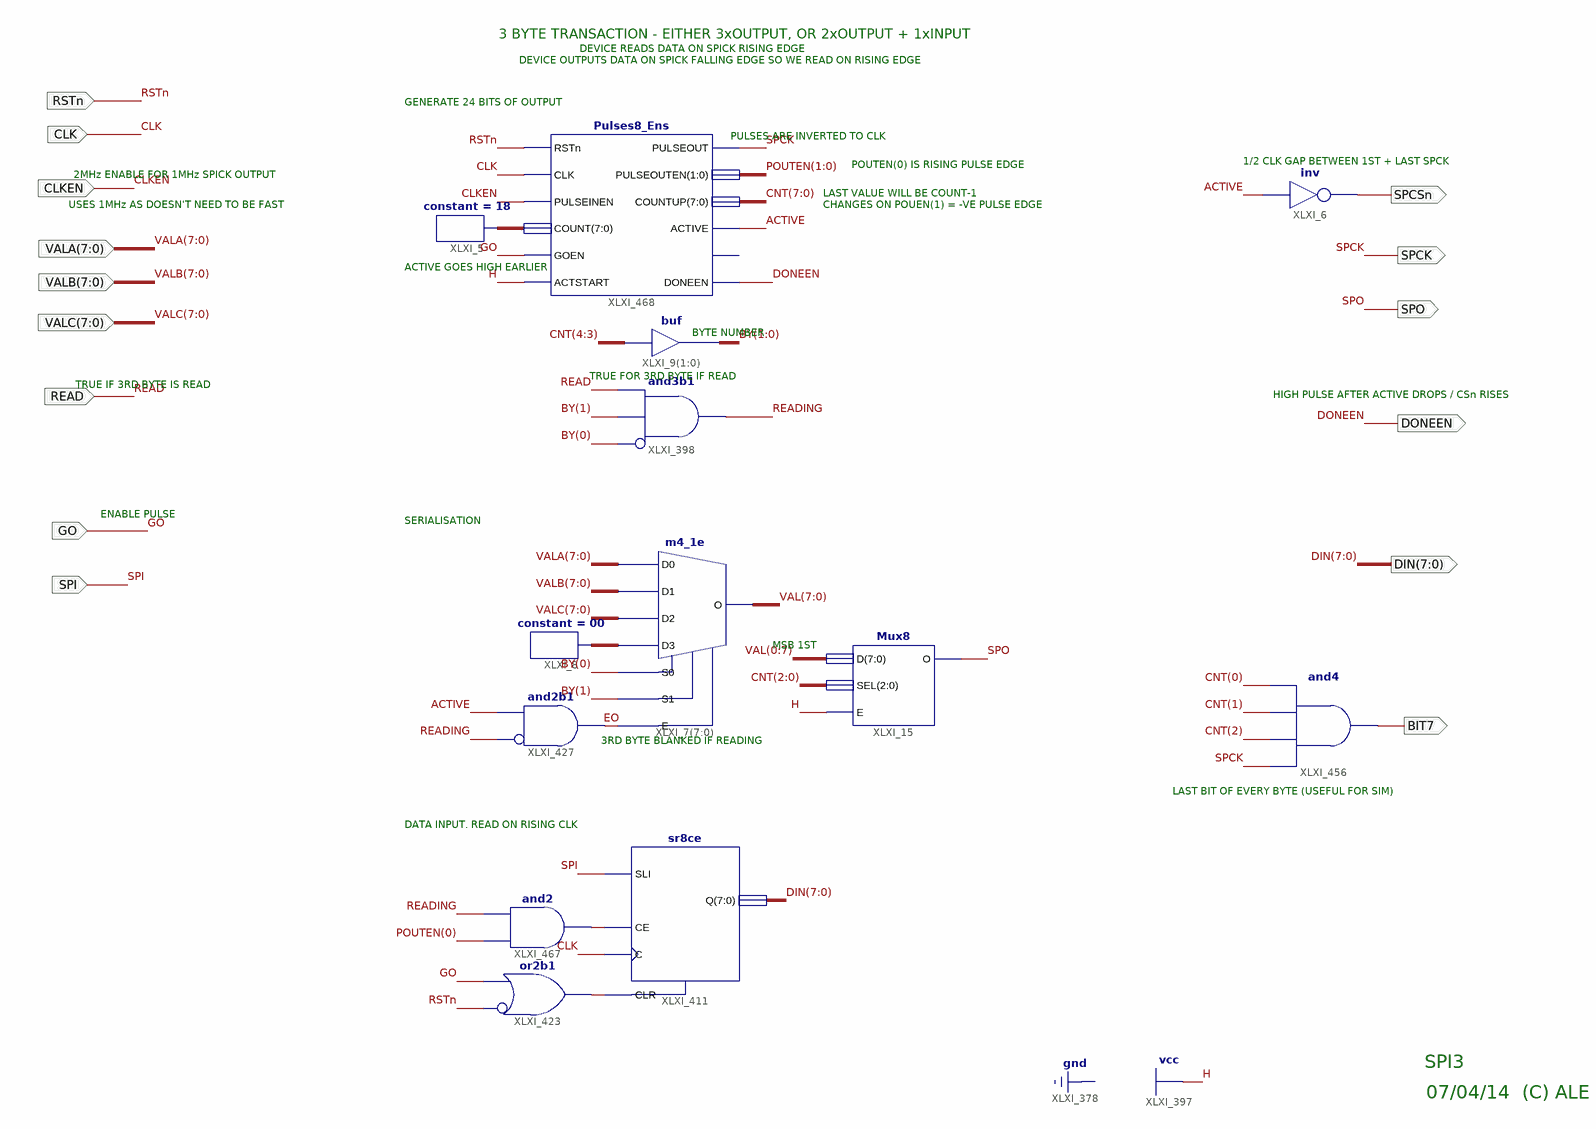
[diagram p0: schematic sheet 1]
// Xilinx ISE schematic Spi3.sch (spartan3e) as structural Verilog: 13 symbols, 15 ports
module Spi3 (
  input  RSTn,
  input  CLK,
  input  [7:0] VALA,
  input  [7:0] VALB,
  input  [7:0] VALC,
  input  READ,
  input  GO,
  input  SPI,
  input  CLKEN,
  output SPCK,
  output SPO,
  output [7:0] DIN,
  output SPCSn,
  output DONEEN,
  output BIT7
);

  wire ACTIVE, EO, READING, XLXN_129, XLXN_165;
  wire [1:0] BY, POUTEN;
  wire [7:0] CNT, VAL, XLXN_7, XLXN_23;

  m4_1e XLXI_7[7:0] (.D0(VALA), .D1(VALB), .D2(VALC), .D3(XLXN_23), .E(EO), .S0(BY[0]), .S1(BY[1]), .O(VAL));
  constant #(.CValue("00")) XLXI_8 (.O(XLXN_23));
  and XLXI_427 (EO, ~READING, ACTIVE);  // and2b1
  Mux8 XLXI_15 (
    .D({VAL[0], VAL[1], VAL[2], VAL[3], VAL[4], VAL[5], VAL[6], VAL[7]}), .E(1'b1), .O(SPO), .SEL(CNT[2:0]));
  not XLXI_6 (SPCSn, ACTIVE);
  sr8ce XLXI_411 (.C(CLK), .CE(XLXN_165), .CLR(XLXN_129), .SLI(SPI), .Q(DIN));
  or XLXI_423 (XLXN_129, ~RSTn, GO);  // or2b1
  and XLXI_456 (BIT7, SPCK, CNT[2], CNT[1], CNT[0]);
  constant #(.CValue("18")) XLXI_5 (.O(XLXN_7));
  and XLXI_467 (XLXN_165, POUTEN[0], READING);
  and XLXI_398 (READING, ~BY[0], BY[1], READ);  // and3b1
  assign BY = CNT[4:3];  // buf XLXI_9[1..0], 2 bits wide
  Pulses8_Ens XLXI_468 (
    .ACTIVE(ACTIVE), .ACTSTART(1'b1), .CLK(CLK), .COUNT(XLXN_7), .COUNTUP(CNT), .DONEEN(DONEEN), .GOEN(GO),
    .PULSEINEN(CLKEN), .PULSEOUT(SPCK), .PULSEOUTEN(POUTEN), .RSTn(RSTn));  // open: TCNT

  // Notes on the sheet:
  //   3 BYTE TRANSACTION - EITHER 3xOUTPUT, OR 2xOUTPUT + 1xINPUT
  //   DEVICE READS DATA ON SPICK RISING EDGE
  //   DEVICE OUTPUTS DATA ON SPICK FALLING EDGE SO WE READ ON RISING EDGE
  //   GENERATE 24 BITS OF OUTPUT
  //   PULSES ARE INVERTED TO CLK
  //   1/2 CLK GAP BETWEEN 1ST + LAST SPCK
  //   POUTEN(0) IS RISING PULSE EDGE
  //   2MHz ENABLE FOR 1MHz SPICK OUTPUT
  //   LAST VALUE WILL BE COUNT-1
  //   USES 1MHz AS DOESN'T NEED TO BE FAST
  //   CHANGES ON POUEN(1) = -VE PULSE EDGE
  //   ACTIVE GOES HIGH EARLIER
  //   BYTE NUMBER
  //   TRUE FOR 3RD BYTE IF READ
  //   TRUE IF 3RD BYTE IS READ
  //   HIGH PULSE AFTER ACTIVE DROPS / CSn RISES
  //   ENABLE PULSE
  //   SERIALISATION
  //   MSB 1ST
  //   3RD BYTE BLANKED IF READING
  //   LAST BIT OF EVERY BYTE (USEFUL FOR SIM)
  //   DATA INPUT. READ ON RISING CLK
  //   SPI3
  //   07/04/14  (C) ALE
endmodule
